# Altium schematic sheet MCU.SchDoc
size A3; SheetNumber: 1; SheetTotal: 3
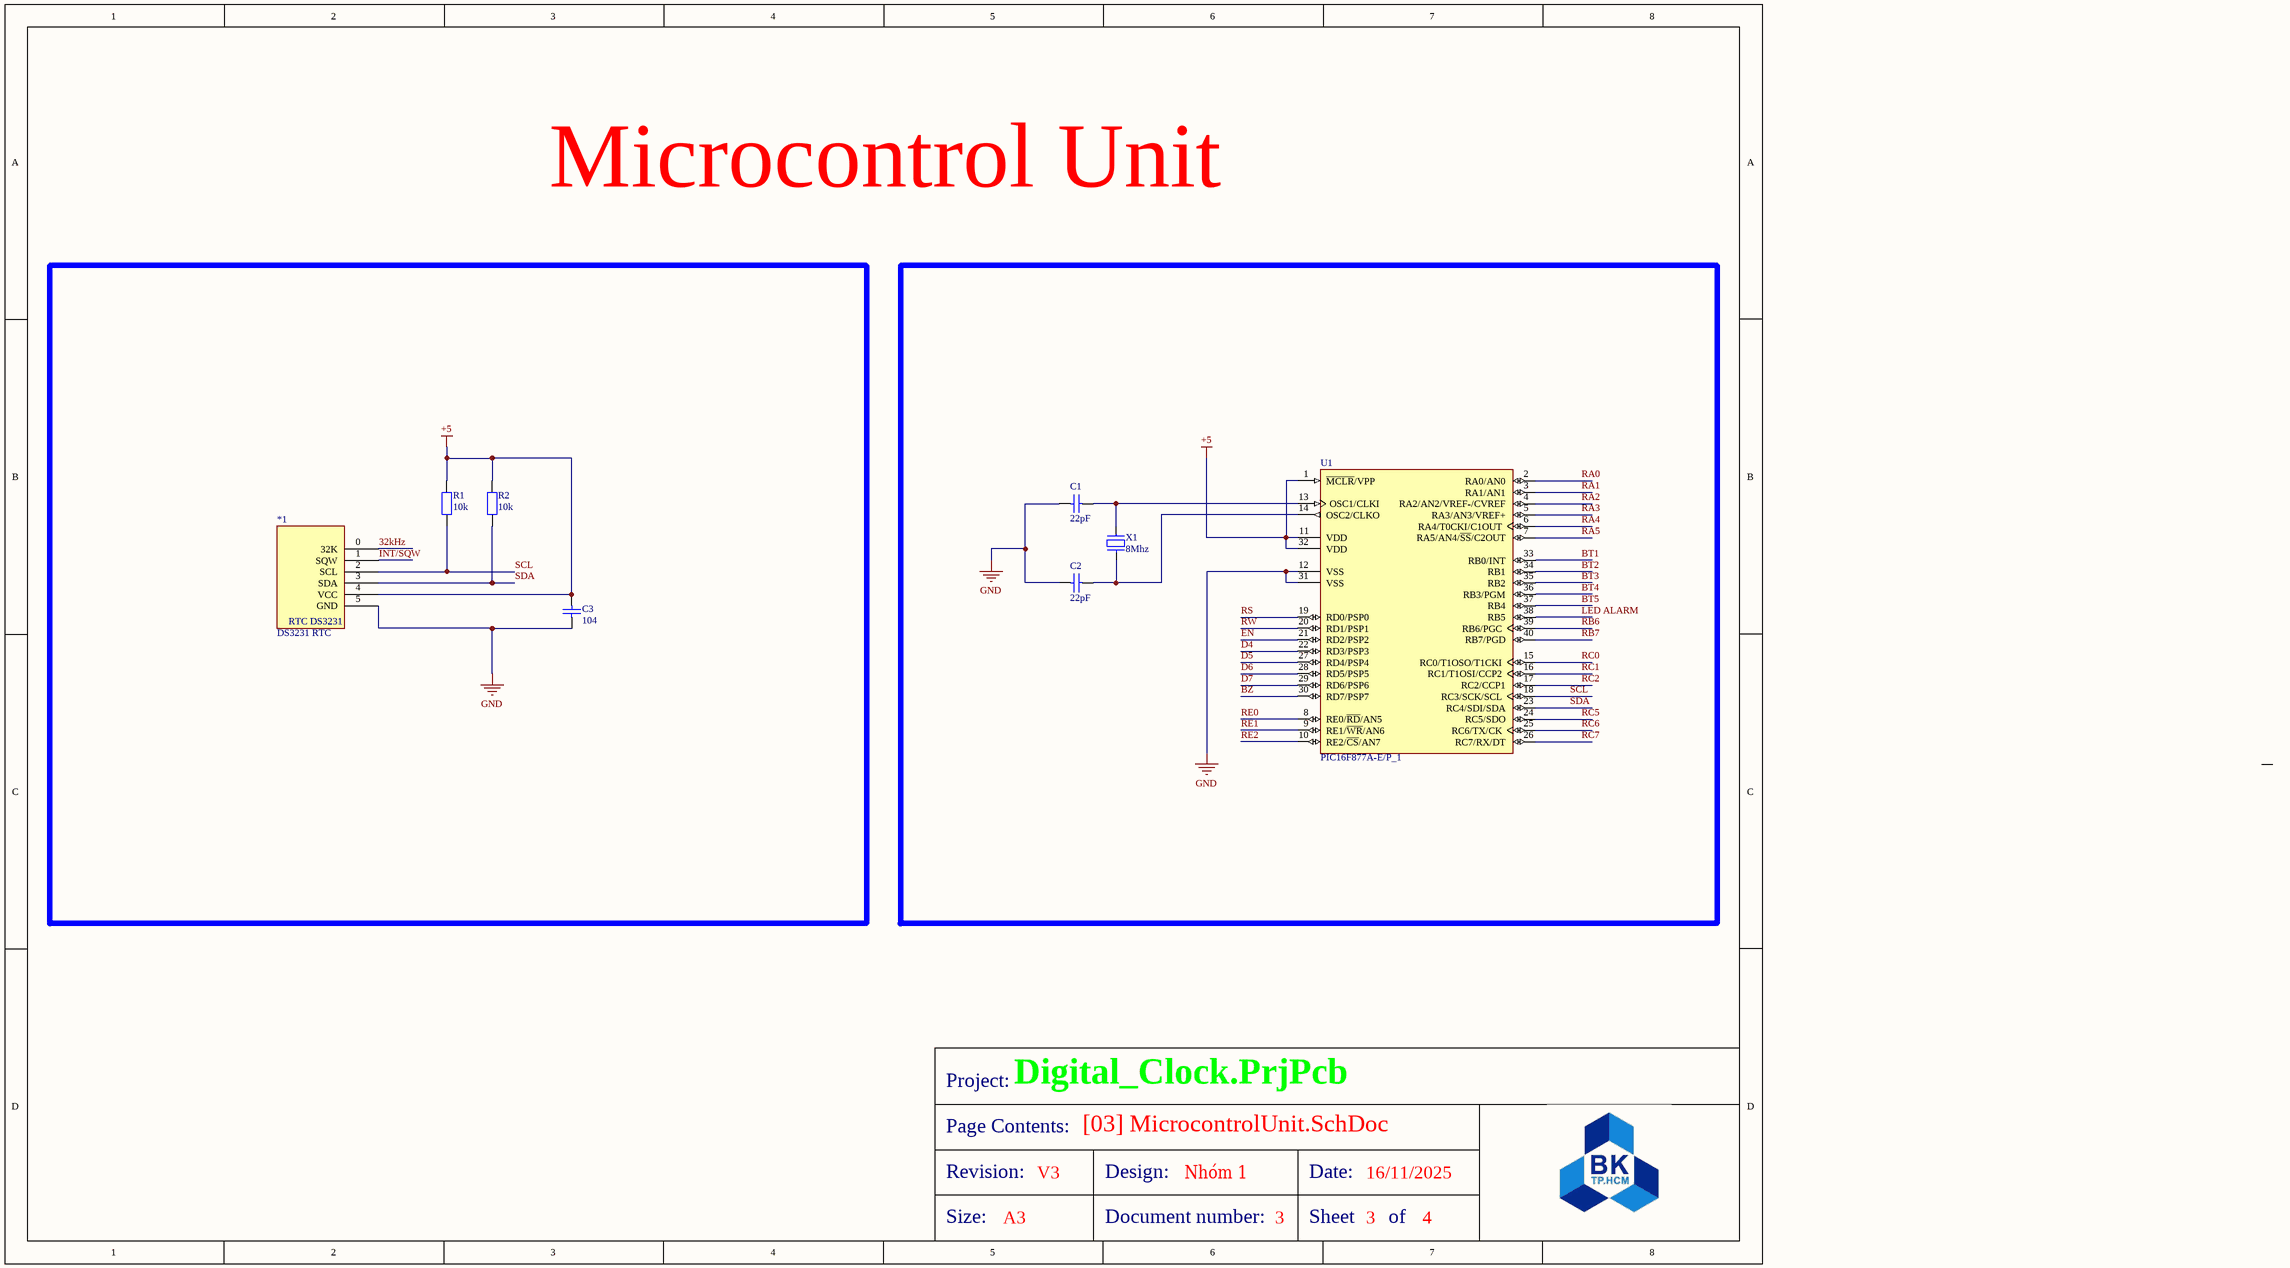
[diagram p0: MCU.SchDoc]

## Parts
*1  DS3231 RTC  [2RTC-DS3231-MODULE]
C1  22pF  [tu gom]
C2  22pF  [tu gom]
C3  104  [tu gom]
R1  10k  [R1/4W]
R2  10k  [R1/4W]
U1  PIC16F877A-E/P_1  [PDIP600-P40]
X1  8Mhz  [XT2]

## Nets
+5: *1.4(VCC) C3.1 R1.2 R2.2 U1.1(~{MCLR}/VPP) U1.11(VDD) U1.32(VDD)
GND: *1.5(GND) C1.2 C2.2 C3.2 U1.12(VSS) U1.31(VSS)
32kHz: *1.0(32K)
BT1: U1.33(RB0/INT)
BT2: U1.34(RB1)
BT3: U1.35(RB2)
BT4: U1.36(RB3/PGM)
BT5: U1.37(RB4)
BZ: U1.30(RD7/PSP7)
D4: U1.22(RD3/PSP3)
D5: U1.27(RD4/PSP4)
D6: U1.28(RD5/PSP5)
D7: U1.29(RD6/PSP6)
EN: U1.21(RD2/PSP2)
INT/SQW: *1.1(SQW)
LED ALARM: U1.38(RB5)
RA0: U1.2(RA0/AN0)
RA1: U1.3(RA1/AN1)
RA2: U1.4(RA2/AN2/VREF-/CVREF)
RA3: U1.5(RA3/AN3/VREF+)
RA4: U1.6(RA4/T0CKI/C1OUT)
RA5: U1.7(RA5/AN4/~{SS}/C2OUT)
RB6: U1.39(RB6/PGC)
RB7: U1.40(RB7/PGD)
RC0: U1.15(RC0/T1OSO/T1CKI)
RC1: U1.16(RC1/T1OSI/CCP2)
RC2: U1.17(RC2/CCP1)
RC5: U1.24(RC5/SDO)
RC6: U1.25(RC6/TX/CK)
RC7: U1.26(RC7/RX/DT)
RE0: U1.8(RE0/~{RD}/AN5)
RE1: U1.9(RE1/~{WR}/AN6)
RE2: U1.10(RE2/~{CS}/AN7)
RS: U1.19(RD0/PSP0)
RW: U1.20(RD1/PSP1)
SCL: *1.2(SCL) R1.1 U1.18(RC3/SCK/SCL)
SDA: *1.3(SDA) R2.1 U1.23(RC4/SDI/SDA)
NetC1_1: C1.1 U1.13(OSC1/CLKI) X1.1
NetC2_1: C2.1 U1.14(OSC2/CLKO) X1.2

## Notes on the sheet
- Microcontrol Unit
- Project:
- Digital_Clock.PrjPcb
- Page Contents:
- [03] MicrocontrolUnit.SchDoc
- Revision:
- Size:
- A3
- V3
- Design:
- Document number:
- Nhóm 1
- 3
- Date:
- Sheet
- 16/11/2025
- of
- 4
- (in symbol DS3231 RTC) RTC DS3231

## Library data of the parts
C1 C2 = Tu gom 22pF 50V: Cắm; Don_Vi: Con; So_Chan: 2; Ten_Linh_Kien: Tụ gốm 22P 50V; Ma_Hang: MH004771; Chung_Loai: Cắm; Kieu_Chan: *
C3 = Tu gom 104 50V: Cắm; So_Chan: 2; Ten_Linh_Kien: Tụ gốm 104 100nF 50V; Don_Vi: Con; Ma_Hang: MH004761; Chung_Loai: Cắm; Kieu_Chan: *
R1 R2 = R1/4W: Resistor 1/4W; Value: R1/4W - 1K
U1 = PIC16F877A-E/P_1: Enhanced FLASH Microcontroller, 8K (x14-Bit words) FLASH, 368 Bytes RAM, 40-Pin PDIP, Standard VDD Range, Extended Temperature; ComponentAvailability: Unknown. Contact manufacturer to determine status.; Published: 11-Oct-2004; LatestRevisionDate: 29-Jan-2009; LatestRevisionNote: Sch. layout revised. 3D Model Removed.; DatasheetVersion: revB, Oct-2003; PackageVersion: revBB, Aug-2009; PackageReference: PDIP600-P40; Publisher: Altium Limited; PackageDescription: 40-Lead Plastic Dual In-Line (P) - 600 mil Body [PDIP]; Supplier 1: Digi-Key; Supplier Part Number 1: PIC16F877A-E/P-ND; Supplier 2: Farnell; Supplier Part Number 2: 1567990; ComponentLink1Description: Datasheet; ComponentLink1URL: http://ww1.microchip.com/downloads/en/DeviceDoc/39582b.pdf; ComponentLink2Description: Packaging Specification; ComponentLink2URL: http://www.microchip.com/stellent/groups/techpub_sg/documents/packagingspec/en012702.pdf; ComponentLink3Description: Microchip.com Home; ComponentLink3URL: http://www.microchip.com/
X1 = XT2: Crystal For all Crystal 2pin.; Value: 8Mhz